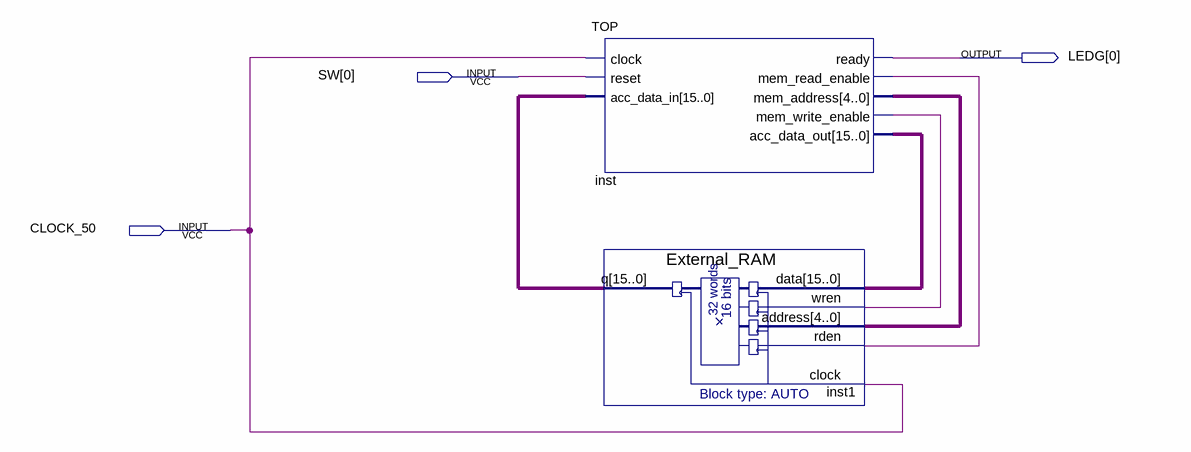
[diagram p0: schematic sheet]
// Quartus schematic Q2.bdf as structural Verilog: 2 symbols, 3 pins
module Q2 (
  input  [0:0] SW,
  input  CLOCK_50,
  output [0:0] LEDG
);

  wire inst_mem_read_enable, inst_mem_write_enable;
  wire [4:0] inst_mem_address;
  wire [15:0] inst1_q, inst_acc_data_out;

  TOP inst (
    .clock(CLOCK_50), .reset(SW[0]), .acc_data_in(inst1_q), .ready(LEDG[0]),
    .mem_read_enable(inst_mem_read_enable), .mem_address(inst_mem_address),
    .mem_write_enable(inst_mem_write_enable), .acc_data_out(inst_acc_data_out));
  External_RAM inst1 (
    .data(inst_acc_data_out), .wren(inst_mem_write_enable), .address(inst_mem_address),
    .rden(inst_mem_read_enable), .clock(CLOCK_50), .q(inst1_q));
endmodule
